# Altium schematic sheet Dev-Headers.SchDoc
size A4
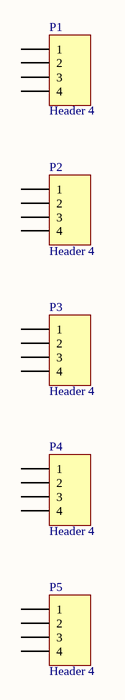
[diagram p0: Dev-Headers.SchDoc]

## Parts
P1  Header 4  [HDR1X4]
P2  Header 4  [HDR1X4]
P3  Header 4  [HDR1X4]
P4  Header 4  [HDR1X4]
P5  Header 4  [HDR1X4]

## Nets

Not connected (* = marked no-connect by the designer): P1 1 2 3 4; P2 1 2 3 4; P3 1 2 3 4; P4 1 2 3 4; P5 1 2 3 4

## Notes on the sheet
- Title
- Size:
- Date:
- Engineer
- A4
- Number:
- Sheet
- of
- Approved
- Revision:
- UC Riverside
- www.highlanderracing.org <https://www.highlanderracing.org>
- File:

## Library data of the parts
P1-P5 = Header 4: Header, 4-Pin; LatestRevisionDate: 17-Jul-2002; LatestRevisionNote: Re-released for DXP Platform.; Publisher: Altium Limited